# Altium project ENGR480_Boost_Converter .PrjPcb
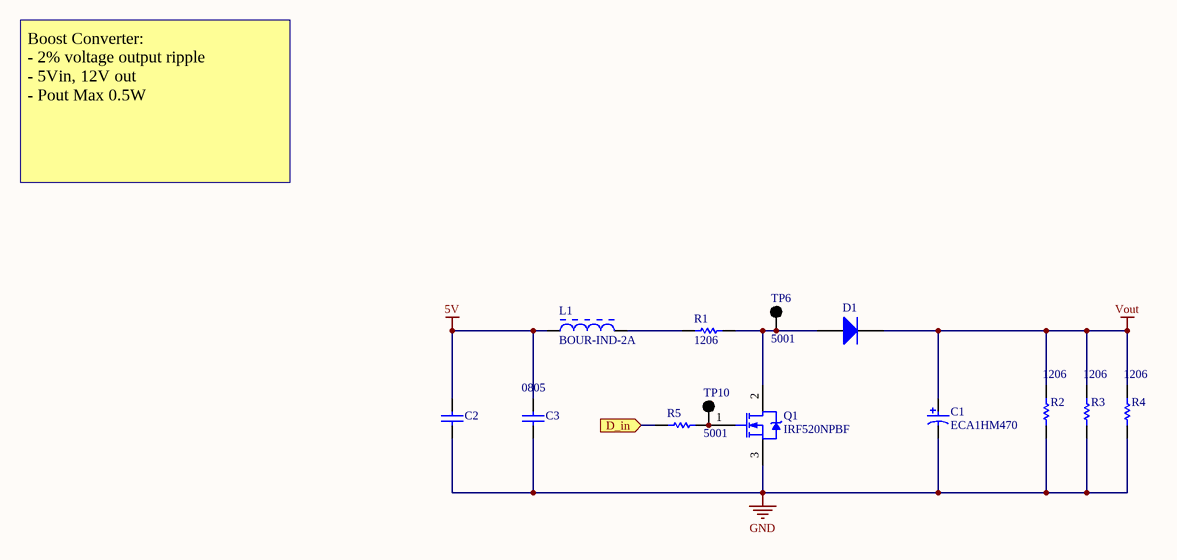
[diagram p0: Boost_converter.SchDoc]
4 sheets, 67 parts. Net scope: flat (ports and power ports of the same name join across sheets).
Board file: Boost_Converter.PcbDoc
Sheets:
  Boost_converter.SchDoc
  State_feedback.SchDoc
  Signal_generator.SchDoc
  Power.SchDoc

## Sheet Boost_converter.SchDoc
size A4

### Parts
C1  ECA1HM470  [CAPPR55-250-1120X630X1220]
C2  CAP 0.5pF 50V 0805(2012)  [CAPC0805(2012)75_M]  (value not drawn)
C3  Case-EIA: 0805  [CAPC0805(2012)75_M]  (hidden comment: CAP 0.5pF 50V 0805(2012))
D1  (no value)  [DIOD-S1M-13-F-SMA-2_V]
L1  BOUR-IND-2A  [SRR1208 Inductor]
Q1  IRF520NPBF  [INTR-TO-220AB-3]
R1  Case-EIA: 1206  [RESC1206(3216)_M]  (hidden comment: 1K43 1% 1206(3216))
R2  Case-EIA: 1206  [RESC1206(3216)_M]  (hidden comment: 1K43 1% 1206(3216))
R3  Case-EIA: 1206  [RESC1206(3216)_M]  (hidden comment: 1K43 1% 1206(3216))
R4  Case-EIA: 1206  [RESC1206(3216)_M]  (hidden comment: 1K43 1% 1206(3216))
R5  1K43 1% 1206(3216)  [RESC1206(3216)_M]  (value not drawn)
TP6  5001  [KSTN-5001]
TP10  5001  [KSTN-5001]

### Ports
D_in (in)

### Nets
5V: C2.2 C3.2 L1.1
GND: C1.2 C2.1 C3.1 Q1.3(S) R2.1 R3.1 R4.1
Vout: C1.1 D1.2(K) R2.2 R3.2 R4.2
NetD1_1: D1.1(A) Q1.2(D) R1.1 TP6.1
NetL1_2: L1.2 R1.2
NetQ1_1: Q1.1(G) R5.1 TP10.1
NetR5_2: R5.2 ; port D_in

### Notes on the sheet
- Boost Converter:
  - 2% voltage output ripple
  - 5Vin, 12V out
  - Pout Max 0.5W

### Library data of the parts
C1 = CMP-2100-03626-1: Aluminum Electrolytic Capacitor, 47 uF, +/- 20%, 50 V, -40 to 85 degC, 2-Pin THD, RoHS, Bulk; Manufacturer: Panasonic; Voltage Rating: 50V; Ripple Current: 130mA; Dissipation Factor: 0.12%; Capacitance: 47uF; Lead Diameter: 0.5mm; Lead/Base Style: Straight; Life (Hours): 2000Hour; Leakage Current: 3uA; Diameter: 6.3mm; REACH SVHC: NoSVHC; Mount: ThroughHole; Package Reference: CAPPR55-250-1120X630X1220; Package Quantity: 200; Case/Package: Radial; Voltage Rating (DC): 50V; Packaging: Bulk; Length: 11.2mm; Manufacturer URL: http://www.panasonic.com/; Datasheet URL: https://industrial.panasonic.com/cdbs/www-data/pdf/RDF0000/ABA0000C1218.pdf; Height: 11.2mm; Package Description: 2-Pin Radial Lead, Dia 6.3 mm, Height 12.2 mm; Min Operating Temperature: -40degC; Tolerance: 20%; Datasheet Version: Rev. 05, 10/2016; RoHSCompliant: true; Termination: Radial; Voltage: 50V; Radiation Hardening: No; Height - Seated (Max): 0.48inch; Max Operating Temperature: 85degC; Lead Pitch: 2.5mm
C2 = CMP-1036-00018-1: CAP 0.5pF 50V ±0.1pF 0805 (2012 Metric) Thickness 0.75mm SMD; Case-EIA: 0805; Case-Metric: 2012; Tolerance: Â±0.1pF; Value: 0.5pF; Technology: SMT; Rated Voltage: 50 V; Max Thickness: 0.75 mm
C3 = CMP-1036-00018-1: CAP 0.5pF 50V ±0.1pF 0805 (2012 Metric) Thickness 0.75mm SMD; Case-Metric: 2012; Tolerance: Â±0.1pF; Value: 0.5pF; Technology: SMT; Rated Voltage: 50 V; Max Thickness: 0.75 mm
D1 = CMP-0639-00001-1: Surface Mount Glass Passivated Rectifier, 1000V, 1 A, -65 to 125 degC, 2-Pin SMA Package, RoHS, Tape and Reel; Manufacturer: Diodes Inc; PartNumber: S1M-13-F; Maximum Reverse Current IR (uA): 5; Maximum Peak Forward Surge Current IFSM (A): 30; Maximum Average Rectified Current IO (A): 1; Peak Repetitive Reverse Voltage VRRM (V): 1000; Total Capacitance CT (pF): 10; Forward Voltage Drop VF (V): 1.1; ComponentLink1URL: http://www.diodes.com/; Operating Temperature Range: -65 to 150 degC; ComponentLink3URL: http://diodes.com/datasheets/ds16003.pdf; ComponentLink3Description: Package Specification; PackageDescription: 2-Pin SMD, Body 4.3 x 2.605 mm, Height 2.3 mm; Mounting Technology: Surface Mount; ComponentLink1Description: Manufacturer URL; PackageReference: S1M-13-F-SMA-2; ComponentLink2URL: http://diodes.com/datasheets/ds16003.pdf; ComponentLink2Description: Datasheet; RoHS: TRUE; DatasheetVersion: Rev. 22 - 2; Packing: Tape and Reel; PackageVersion: Rev. 22 - 2
L1 = BOUR-IND-2A: Manufacturer PN: SRR1208-272KLTR-ND; Inductance: 2.7mH
Q1 = CMP-2100-03647-1: HEXFET(R) Power MOSFET, 100 V, 9.7 A, 0.2 Ohm, -55 to 175 degC, 3-Pin FM (TO-220AB), RoHS, Tube; Manufacturer: International Rectifier; Element Configuration: Single; Rds On Max: 200mOhm; Drain to Source Voltage (Vdss): 100V; Number of Elements: 1; Continuous Drain Current (ID): 9.7A; Input Capacitance: 330pF; Gate to Source Voltage (Vgs): 20V; Power Dissipation: 48W; Rise Time: 23ns; Turn-Off Delay Time: 32ns; Turn-On Delay Time: 4.5ns; Datasheet URL: http://www.infineon.com/dgdl/irf520npbf.pdf?fileId=5546d462533600a4015355e340711985; Max Operating Temperature: 175degC; Height: 15.24mm; RoHSCompliant: true; Package Description: 3-Pin Flange Mount, Body 4.445 x 10.415 mm, Pitch 2.54 mm; Manufacturer URL: http://internationalrectifier.com/; Length: 10.54mm; Mount: ThroughHole; Lead Free: LeadFree; Drain to Source Resistance: 200mOhm; Drain to Source Breakdown Voltage: 100V; Number of Pins: 3; Case/Package: TO-220AB; Package Quantity: 50; Lead Pitch: 2.54mm; REACH SVHC: NoSVHC; Package Reference: TO-220AB; Radiation Hardening: No; Packaging: Rail/Tube; Min Operating Temperature: -55degC; Width: 4.69mm; Fall Time: 23ns; Max Power Dissipation: 48W; Datasheet Version: 37926.0; Voltage Rating (DC): 100V; Current Rating: 9.7A
R1-R4 = CMP-1014-00526-1: 1K43 0.25W 1% 1206 (3216 Metric)  SMD; Value: 1430.00 Ohm; Case-Metric: 3216; Power: 0.25 W; Technology: SMT; Tolerance: 1 %
R5 = CMP-1014-00526-1: 1K43 0.25W 1% 1206 (3216 Metric)  SMD; Value: 1430.00 Ohm; Case-EIA: 1206; Case-Metric: 3216; Power: 0.25 W; Technology: SMT; Tolerance: 1 %
TP6 TP10 = CMP-2000-05181-1: Test Point, Black, 1-Pin THD, RoHS, Bulk; Manufacturer: Keystone; Other Names: 5001K; Catalog Drawings: 5000Series; Kits: DKTGRS232C-KIT-ND / -TTLCONVERTER; Online Catalog: ColorCodedTestPoints; Datasheet URL: https://ciiva.com/datasheet-click-2917627?src=ciiva&sig=bd195616; Family: TestPoints; RoHS Information: RoHSComplianceStatement; Datasheet Version: Rev. G, 12/2008; Color: Black; Category: TestandMeasurement; Standard Package: 100; Manufacturer URL: http://www.keyelco.com/; Material: Base,Nylon46,UL94V-0; Type: PCTestPoint,Miniature; Series: THM; Packaging: Bulk

## Sheet State_feedback.SchDoc
size A4
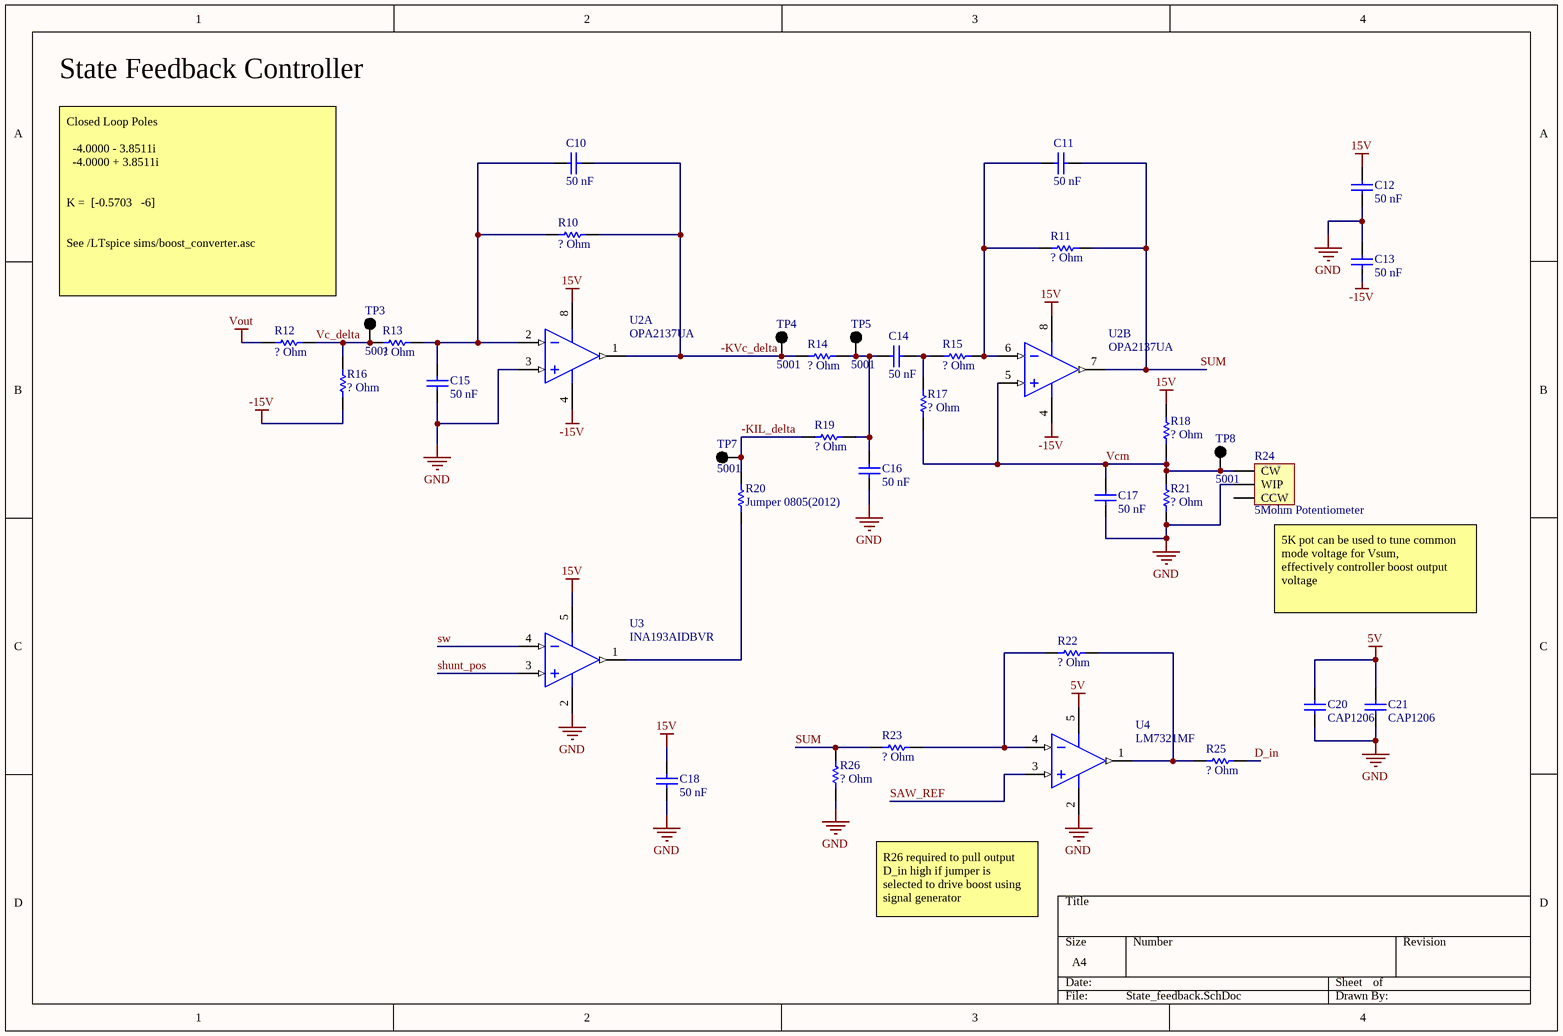
[diagram p1: State_feedback.SchDoc]

### Parts
C10  50 nF  [CAPC0805(2012)75_M]
C11  50 nF  [CAPC0805(2012)75_M]
C12  50 nF  [CAPC0805(2012)75_M]
C13  50 nF  [CAPC0805(2012)75_M]
C14  50 nF  [CAPC0805(2012)75_M]
C15  50 nF  [CAPC0805(2012)75_M]
C16  50 nF  [CAPC0805(2012)75_M]
C17  50 nF  [CAPC0805(2012)75_M]
C18  50 nF  [CAPC0805(2012)75_M]
C20  CAP1206  [CAPC1206(3216)150_L]
C21  CAP1206  [CAPC1206(3216)150_L]
R10  ? Ohm  [RESC0805(2012)_M]
R11  ? Ohm  [RESC0805(2012)_M]
R12  ? Ohm  [RESC0805(2012)_M]
R13  ? Ohm  [RESC0805(2012)_M]
R14  ? Ohm  [RESC0805(2012)_M]
R15  ? Ohm  [RESC0805(2012)_M]
R16  ? Ohm  [RESC0805(2012)_M]
R17  ? Ohm  [RESC0805(2012)_M]
R18  ? Ohm  [RESC0805(2012)_M]
R19  ? Ohm  [RESC0805(2012)_M]
R20  Jumper 0805(2012)  [RESC0805(2012)_N]
R21  ? Ohm  [RESC0805(2012)_M]
R22  ? Ohm  [RESC0805(2012)_M]
R23  ? Ohm  [RESC0805(2012)_M]
R24  5Mohm Potentiometer  [5k_pot]
R25  ? Ohm  [RESC0805(2012)_M]
R26  ? Ohm  [RESC0805(2012)_M]
TP3  5001  [KSTN-5001]
TP4  5001  [KSTN-5001]
TP5  5001  [KSTN-5001]
TP7  5001  [KSTN-5001]
TP8  5001  [KSTN-5001]
U2  OPA2137UA  [D0008A_M]  (parts A,B of 2)
U3  INA193AIDBVR  [DBV0005A_M]
U4  LM7321MF  [MF05A_L]

### Nets
5V: C20.2 C21.2 U4.5(V+)
15V: C12.1 C18.1 R18.2 U2.8(V+) U3.5(V+)
-15V: C13.2 R16.1 U2.4(V-)
GND: C12.2 C13.1 C15.2 C16.1 C17.1 C18.2 C20.1 C21.1 R21.1 R24.2(WIP) R26.1 U2.3(IN_A+) U3.2(GND) U4.2(V-)
Vout: R12.1
-KIL_delta: R19.1 R20.2 TP7.1
-KVc_delta: C10.2 R10.2 R14.1 TP4.1 U2.1(OUT_A)
D_in: R25.2
SAW_REF: U4.3(IN+)
shunt_pos: U3.3(VIN+)
SUM: C11.2 R11.2 R23.1 R26.2 U2.7(OUT_B)
sw: U3.4(VIN-)
Vc_delta: R12.2 R13.1 R16.2 TP3.1
Vcm: C17.2 R17.1 R18.1 R21.2 R24.1(CW) TP8.1 U2.5(IN_B+)
NetC10_1: C10.1 C15.1 R10.1 R13.2 U2.2(IN_A-)
NetC11_1: C11.1 R11.1 R15.2 U2.6(IN_B-)
NetC14_1: C14.1 C16.2 R14.2 R19.2 TP5.1
NetC14_2: C14.2 R15.1 R17.2
NetR20_1: R20.1 U3.1(OUT)
NetR22_1: R22.1 R23.2 U4.4(IN-)
NetR22_2: R22.2 R25.1 U4.1(OUT)

Not connected (* = marked no-connect by the designer): R24 3(CCW)

### Notes on the sheet
- State Feedback Controller
- Closed Loop Poles
  -4.0000 - 3.8511i
  -4.0000 + 3.8511i
  K =  [-0.5703   -6]
  See /LTspice sims/boost_converter.asc
- (near R24) 5K pot can be used to tune common mode voltage for Vsum,
  effectively controller boost output voltage
- R26 required to pull output D_in high if jumper is selected to drive boost using signal generator

### Library data of the parts
C10-C18 = CMP-1036-00018-1: as C2 on sheet Boost_converter; Value: 0.5pF; Technology: SMT; Rated Voltage: 50 V; Max Thickness: 0.75 mm
C20 C21 = CMP-1590-00001-1: 1206 (3216 Metric) Chip Capacitor; Case-Metric: 3216; Case-EIA: 1206; PackageReference: CAPC1206(3216)150
R10-R19 R21-R23 R25 R26 = CMP-1013-00017-1: 4R3 0.125W 5% 0805 (2012 Metric)  SMD; Value: 4.30 Ohm; Case-Metric: 2012; Case-EIA: 0805; Tolerance: 5 %; Power: 0.125 W; Technology: SMT
R20 = CMP-1013-00001-1: Jumper 0805 (2012 Metric); Case-EIA: 0805; Value: 0.00 Ohm; Tolerance: None; Case-Metric: 2012; Technology: SMT; Power: None
R24 = 5Mohm Potentiometer: 3296W-1-505LF; Manufacturer PN: 3296W-1-505LF
TP3-TP5 TP7 TP8 = CMP-2000-05181-1: as TP6 on sheet Boost_converter; Datasheet URL: https://ciiva.com/datasheet-click-2917627?src=ciiva&sig=bd195616; Family: TestPoints; RoHS Information: RoHSComplianceStatement; Datasheet Version: Rev. G, 12/2008; Color: Black; Category: TestandMeasurement; Standard Package: 100; Manufacturer URL: http://www.keyelco.com/; Material: Base,Nylon46,UL94V-0; Type: PCTestPoint,Miniature; Series: THM; Packaging: Bulk
U2 = CMP-0017-00406-2: Low Cost FET-Input Operational Amplifier, 4.5 to 36 V, -40 to 85 degC, 8-pin SOIC (D8), Green (RoHS & no Sb/Br); Manufacturer: Texas Instruments; Iq per channel(Max)(mA): 0.27; CMRR(Min)(dB): 70; Sub Family: General Purpose Amplifier, High Supply Voltage Amplifier (>=30V), Low Power Amp (<=500uA); Number of Channels: 2; Offset Drift(Typ)(uV/C): 15; GBW(Typ)(MHz): 1; Rating: Catalog; Vio (25C)(Max)(mV): 3; Total Supply Voltage(Min)(+5V is 5, +/-5V is 10): 4.5; Vn at 1kHz(Typ)(nV/rtHz): 45; IIB(Max)(pA): 100; Total Supply Voltage(Max)(+5V is 5, +/-5V is 10): 36; Slew Rate(Typ)(V/us): 3.5; PackageVersion: 4040047-3/M, 06/2011; ComponentLink3Description: Package Specification; ComponentLink1URL: http://www.ti.com/; ComponentLink2Description: Datasheet; Eco-Plan: Green (RoHS & no Sb/Br); ComponentLink3URL: http://www.ti.com/litv/pdf/msoi002j; PackageReference: D0008A; ComponentLink1Description: Manufacturer URL; PackageDescription: 8-Pin Plastic Small Outline, Body 4.9 x 3.9 mm, Pitch 1.27 mm; ComponentLink2URL: http://www.ti.com/lit/ds/symlink/opa2137.pdf; Mounting Technology: Surface Mount; PartNumber: OPA2137UA; DatasheetVersion: SBOS089; Code_JEDEC: MS-012; PartId: 1
U3 = CMP-0704-00029-2: Voltage Output High-Side Measurement Current Shunt Monitor, 2.7 to 18 V, -40 to 125 degC, 5-pin SOT23 (DBV5), Green (RoHS & no Sb/Br); Manufacturer: Texas Instruments; Quiescent Current (+/-)(Typ)(mA): 0.7; CMRR(Min)(dB): 80; Input Offset (+/-)(Max)(uV): 2000; Vs(Min)(V): 2.7; Rating: Catalog; Vs(Max)(V): 18; Small-Signal Bandwidth(Typ)(MHz): 0.5; Gain(V/V): 20; Common Mode Range(Min)(V): -16; ComponentLink1URL: http://www.ti.com/; Eco-Plan: Green (RoHS & no Sb/Br); Code_JEDEC: MO-178; ComponentLink1Description: Manufacturer URL; ComponentLink2Description: Datasheet; DatasheetVersion: SBOS307F; PackageReference: DBV0005A; Output Type: Voltage; SubFamily: Current Shunt Monitor; ComponentLink3URL: http://www.ti.com/lit/ml/mpds018j/mpds018j.pdf; Mounting Technology: Surface Mount; ComponentLink3Description: Package Specification; ComponentLink2URL: http://www.ti.com/general/docs/lit/getliterature.tsp?genericPartNumber=INA193&fileType=pdf; PartNumber: INA193AIDBVR; PackageDescription: 5-Pin Plastic Small Outline, Body 1.6 x 2.9 mm, Pitch 0.95 mm; PackageVersion: 4073253-4/K, 03/2006; Common Mode Range(Max)(V): 80
U4 = CMP-0055-01343-2: Rail-to-Rail Input/Output, ±15V, High Output Current and Unlimited Capacitive Load Operational Amplifier, 5-pin SOT-23; Manufacturer: National Semiconductor; CompType: Amplifiers; PackageTopMarking: AU4A*XTT; PowerWise: Y; PackageVersion: revD, Aug-2008; DatasheetVersion: Sep-2008; ComponentLink2Description: LM7321 Web Page; PackageReference: MF05A; ComponentLink3Description: MF05A Package Page; ComponentLink3URL: http://www.national.com/packaging/folders/mf05a.html; ComponentLink2URL: http://www.national.com/pf/LM/LM7321.html; PinCount: 5; RevisionNote: Component URLs added; ComponentLink1URL: http://www.national.com/ds/LM/LM7321.pdf; ComponentLink1Description: LM7321 Datasheet; PackageDescription: Molded SOT-23, .115 x .063 x .040 in Body, 5 Lead, .0375 in Pitch; RoHS: Y

## Sheet Signal_generator.SchDoc
size A4
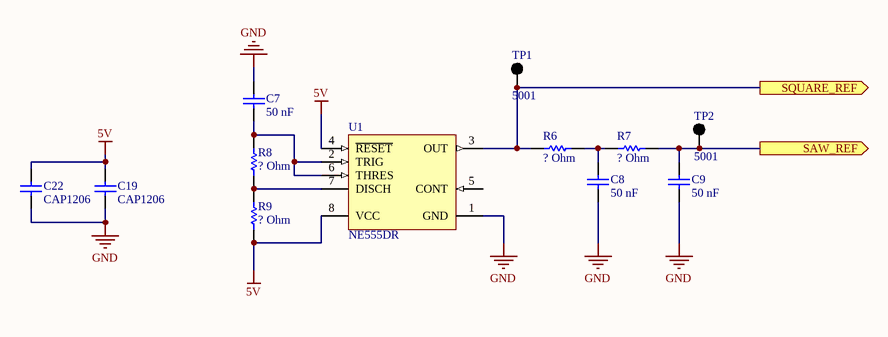
[diagram p2: Signal_generator.SchDoc]

### Parts
C7  50 nF  [CAPC0805(2012)75_M]
C8  50 nF  [CAPC0805(2012)75_M]
C9  50 nF  [CAPC0805(2012)75_M]
C19  CAP1206  [CAPC1206(3216)150_L]
C22  CAP1206  [CAPC1206(3216)150_L]
R6  ? Ohm  [RESC0805(2012)_M]
R7  ? Ohm  [RESC0805(2012)_M]
R8  ? Ohm  [RESC0805(2012)_M]
R9  ? Ohm  [RESC0805(2012)_M]
TP1  5001  [KSTN-5001]
TP2  5001  [KSTN-5001]
U1  NE555DR  [D0008A_M]

### Ports
SAW_REF (out), SQUARE_REF (out)

### Nets
5V: C19.2 C22.2 R9.2 U1.4(~{RESET}) U1.8(VCC)
GND: C7.1 C8.2 C9.2 C19.1 C22.1 U1.1(GND)
NetC7_2: C7.2 R8.1 U1.2(TRIG) U1.6(THRES)
NetC8_1: C8.1 R6.2 R7.1
NetC9_1: C9.1 R7.2 TP2.1 ; port SAW_REF
NetR6_1: R6.1 TP1.1 U1.3(OUT) ; port SQUARE_REF
NetR8_2: R8.2 R9.1 U1.7(DISCH)

Not connected (* = marked no-connect by the designer): U1 5(CONT)

### Library data of the parts
C7-C9 = CMP-1036-00018-1: as C2 on sheet Boost_converter; Value: 0.5pF; Technology: SMT; Rated Voltage: 50 V; Max Thickness: 0.75 mm
C19 C22 = CMP-1590-00001-1: as C20 on sheet State_feedback; PackageReference: CAPC1206(3216)150
R6-R9 = CMP-1013-00017-1: as R10 on sheet State_feedback; Tolerance: 5 %; Power: 0.125 W; Technology: SMT
TP1 TP2 = CMP-2000-05181-1: as TP6 on sheet Boost_converter; Datasheet URL: https://ciiva.com/datasheet-click-2917627?src=ciiva&sig=bd195616; Family: TestPoints; RoHS Information: RoHSComplianceStatement; Datasheet Version: Rev. G, 12/2008; Color: Black; Category: TestandMeasurement; Standard Package: 100; Manufacturer URL: http://www.keyelco.com/; Material: Base,Nylon46,UL94V-0; Type: PCTestPoint,Miniature; Series: THM; Packaging: Bulk
U1 = CMP-1685-00007-1: Precision Timer, 4.5 to 16 V, 0 to 70 degC, 8-Pin SOIC (D8), Green (RoHS & no Sb/Br), Tape and Reel; Forward Voltage: 450 mV; Forward Current: 1 A; Max Surge Current: 30 A; Peak Reverse Current: 500 uA; Case\Package: SMA; PackageReference: D0008A; Width: 2.84 mm; PackageDescription: 8-Pin Small Outline Integrated Circuit, Body 4.9 x 3.9 mm, Pitch 1.27 mm; DatasheetVersion: SLFS022I, 09/2014; ComponentLink2Description: Datasheet; Package Quantity: 1; REACH SVHC: Unknown; Radiation Hardening: No; Height: 2.44 mm; Code_JEDEC: MS-012; Pins: 2; ComponentLink1Description: Manufacturer URL; ComponentLink3Description: Package Specification; ComponentLink3URL: http://www.ti.com/lit/ml/msoi002j/msoi002j.pdf; Length: 4.57 mm; ComponentLink1URL: http://www.ti.com/; Mount: Surface Mount; PackageVersion: 4040047-3/M, 06/2011; ComponentLink2URL: http://www.ti.com/general/docs/lit/getliterature.tsp?genericPartNumber=NE555&fileType=pdf; RoHSCompliant: true; Max Operating Temperature: 125 degC; Packaging: Cut Tape; Min Operating Temperature: -55 degC

## Sheet Power.SchDoc
size A4
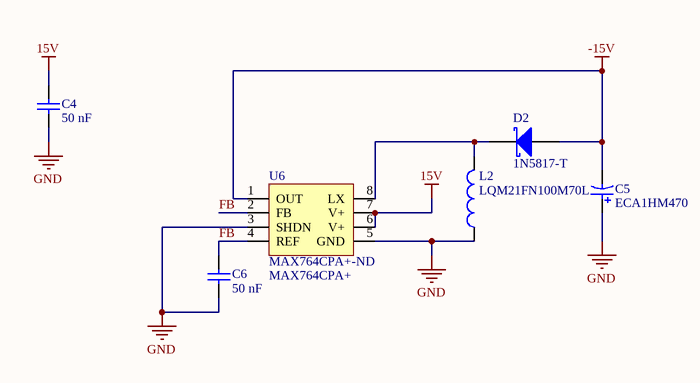
[diagram p3: Power.SchDoc]

### Parts
C4  50 nF  [CAPC0805(2012)75_M]
C5  ECA1HM470  [CAPPR55-250-1120X630X1220]
C6  50 nF  [CAPC0805(2012)75_M]
D2  1N5817-T  [DIOD-DO-41-P-2]
L2  LQM21FN100M70L  [MURA-IND0805_M]
U6  MAX764CPA+-ND  Manufacturer PN: MAX764CPA+  [PDIP300-P8]

### Nets
15V: C4.1 U6.6(V+) U6.7(V+)
-15V: C5.2 D2.1(A) U6.1(OUT)
GND: C4.2 C5.1 C6.2 L2.1 U6.3(SHDN) U6.5(GND)
FB: C6.1 U6.2(FB) U6.4(REF)
NetD2_2: D2.2(K) L2.2 U6.8(LX)

### Library data of the parts
C4 C6 = CMP-1036-00018-1: as C2 on sheet Boost_converter; Value: 0.5pF; Technology: SMT; Rated Voltage: 50 V; Max Thickness: 0.75 mm
C5 = CMP-2100-03626-1: as C1 on sheet Boost_converter; Diameter: 6.3mm; REACH SVHC: NoSVHC; Mount: ThroughHole; Package Reference: CAPPR55-250-1120X630X1220; Package Quantity: 200; Case/Package: Radial; Voltage Rating (DC): 50V; Packaging: Bulk; Length: 11.2mm; Manufacturer URL: http://www.panasonic.com/; Datasheet URL: https://industrial.panasonic.com/cdbs/www-data/pdf/RDF0000/ABA0000C1218.pdf; Height: 11.2mm; Package Description: 2-Pin Radial Lead, Dia 6.3 mm, Height 12.2 mm; Min Operating Temperature: -40degC; Tolerance: 20%; Datasheet Version: Rev. 05, 10/2016; RoHSCompliant: true; Termination: Radial; Voltage: 50V; Radiation Hardening: No; Height - Seated (Max): 0.48inch; Max Operating Temperature: 85degC; Lead Pitch: 2.5mm
D2 = CMP-2000-05521-1: Schottky Barrier Rectifier, 1 A, 20 V, -65 to 125 degC, 2-Pin DO-41, RoHS, Tape and Reel; Manufacturer: DiodesIncorporated; Vrrm - Repetitive Reverse Voltage: 20V; If - Forward Current: 1A; Configuration: Single; Unit Weight: 0.010582oz; Type: SchottkyDiode; Ifsm - Forward Surge Current: 25A; Vf - Forward Voltage: 0.75Vat3A; Ir - Reverse Current: 1000uA; Technology: Si; Length: 5.21mm; Product: SchottkyRectifiers; Package Reference: DO-41-P-2; Package / Case: DO-41; Datasheet URL: http://www.diodes.com/_files/datasheets/ds23001.pdf; Operating Temperature Range: -65Cto+125C; Mounting Style: ThroughHole; Manufacturer URL: http://www.diodes.com/; Series: 1N58; Minimum Operating Temperature: -65C; Height: 2.72mm; Brand: DiodesIncorporated; Maximum Operating Temperature: +125C; Datasheet Version: Rev. 8-2, 05/2009; Factory Pack Quantity: 5000; Width: 2.72mm; RoHS: True; Product Category: SchottkyDiodes&Rectifiers; Package Description: 2-Pin Through Hole Device, Body 4.635 x 2.36 mm, Pin Spacing 7.85 mm; Packaging: Reel; Termination Style: ThroughHole; Mounting Technology: ThroughHole
L2 = CMP-2000-06587-1: Fixed Inductor, 10 uH, +/-20%, -55 to 125 degC, 2-Pin SMD (0805), RoHS, Tape and Reel; Manufacturer: Murata; Tolerance (%): 20%; DC Resistance: 0.6; Inductance-Nom: 10H; Rated Current-Max: 100mA; Package Reference: IND0805; Case Size/Dimension: 0805; Manufacturer URL: http://www.murata.com/; Package Description: 2-Pin Surface Mount Device, Body 2 x 1.25 mm; Datasheet URL: http://psearch.en.murata.com/inductor/product/LQM21FN100M70%23.pdf; Mounting Technology: SurfaceMount; Datasheet Version: 05/2016
U6 = MAX764CPA+-ND: IC REG BUCK BST INV ADJ/-5V 8DIP; HTML: https://www.digikey.ca/product-detail/en/maxim-integrated/MAX764CPA/MAX764CPA-ND/1512331

## Nets that join several sheets
5V: Boost_converter (C2.2 C3.2 L1.1), State_feedback (C20.2 C21.2 U4.5), Signal_generator (5 pins)
15V: State_feedback (5 pins), Power (C4.1 U6.6 U6.7)
-15V: State_feedback (C13.2 R16.1 U2.4), Power (C5.2 D2.1 U6.1)
GND: Boost_converter (7 pins), State_feedback (14 pins), Signal_generator (6 pins), Power (6 pins)
Vout: Boost_converter (5 pins), State_feedback (R12.1)